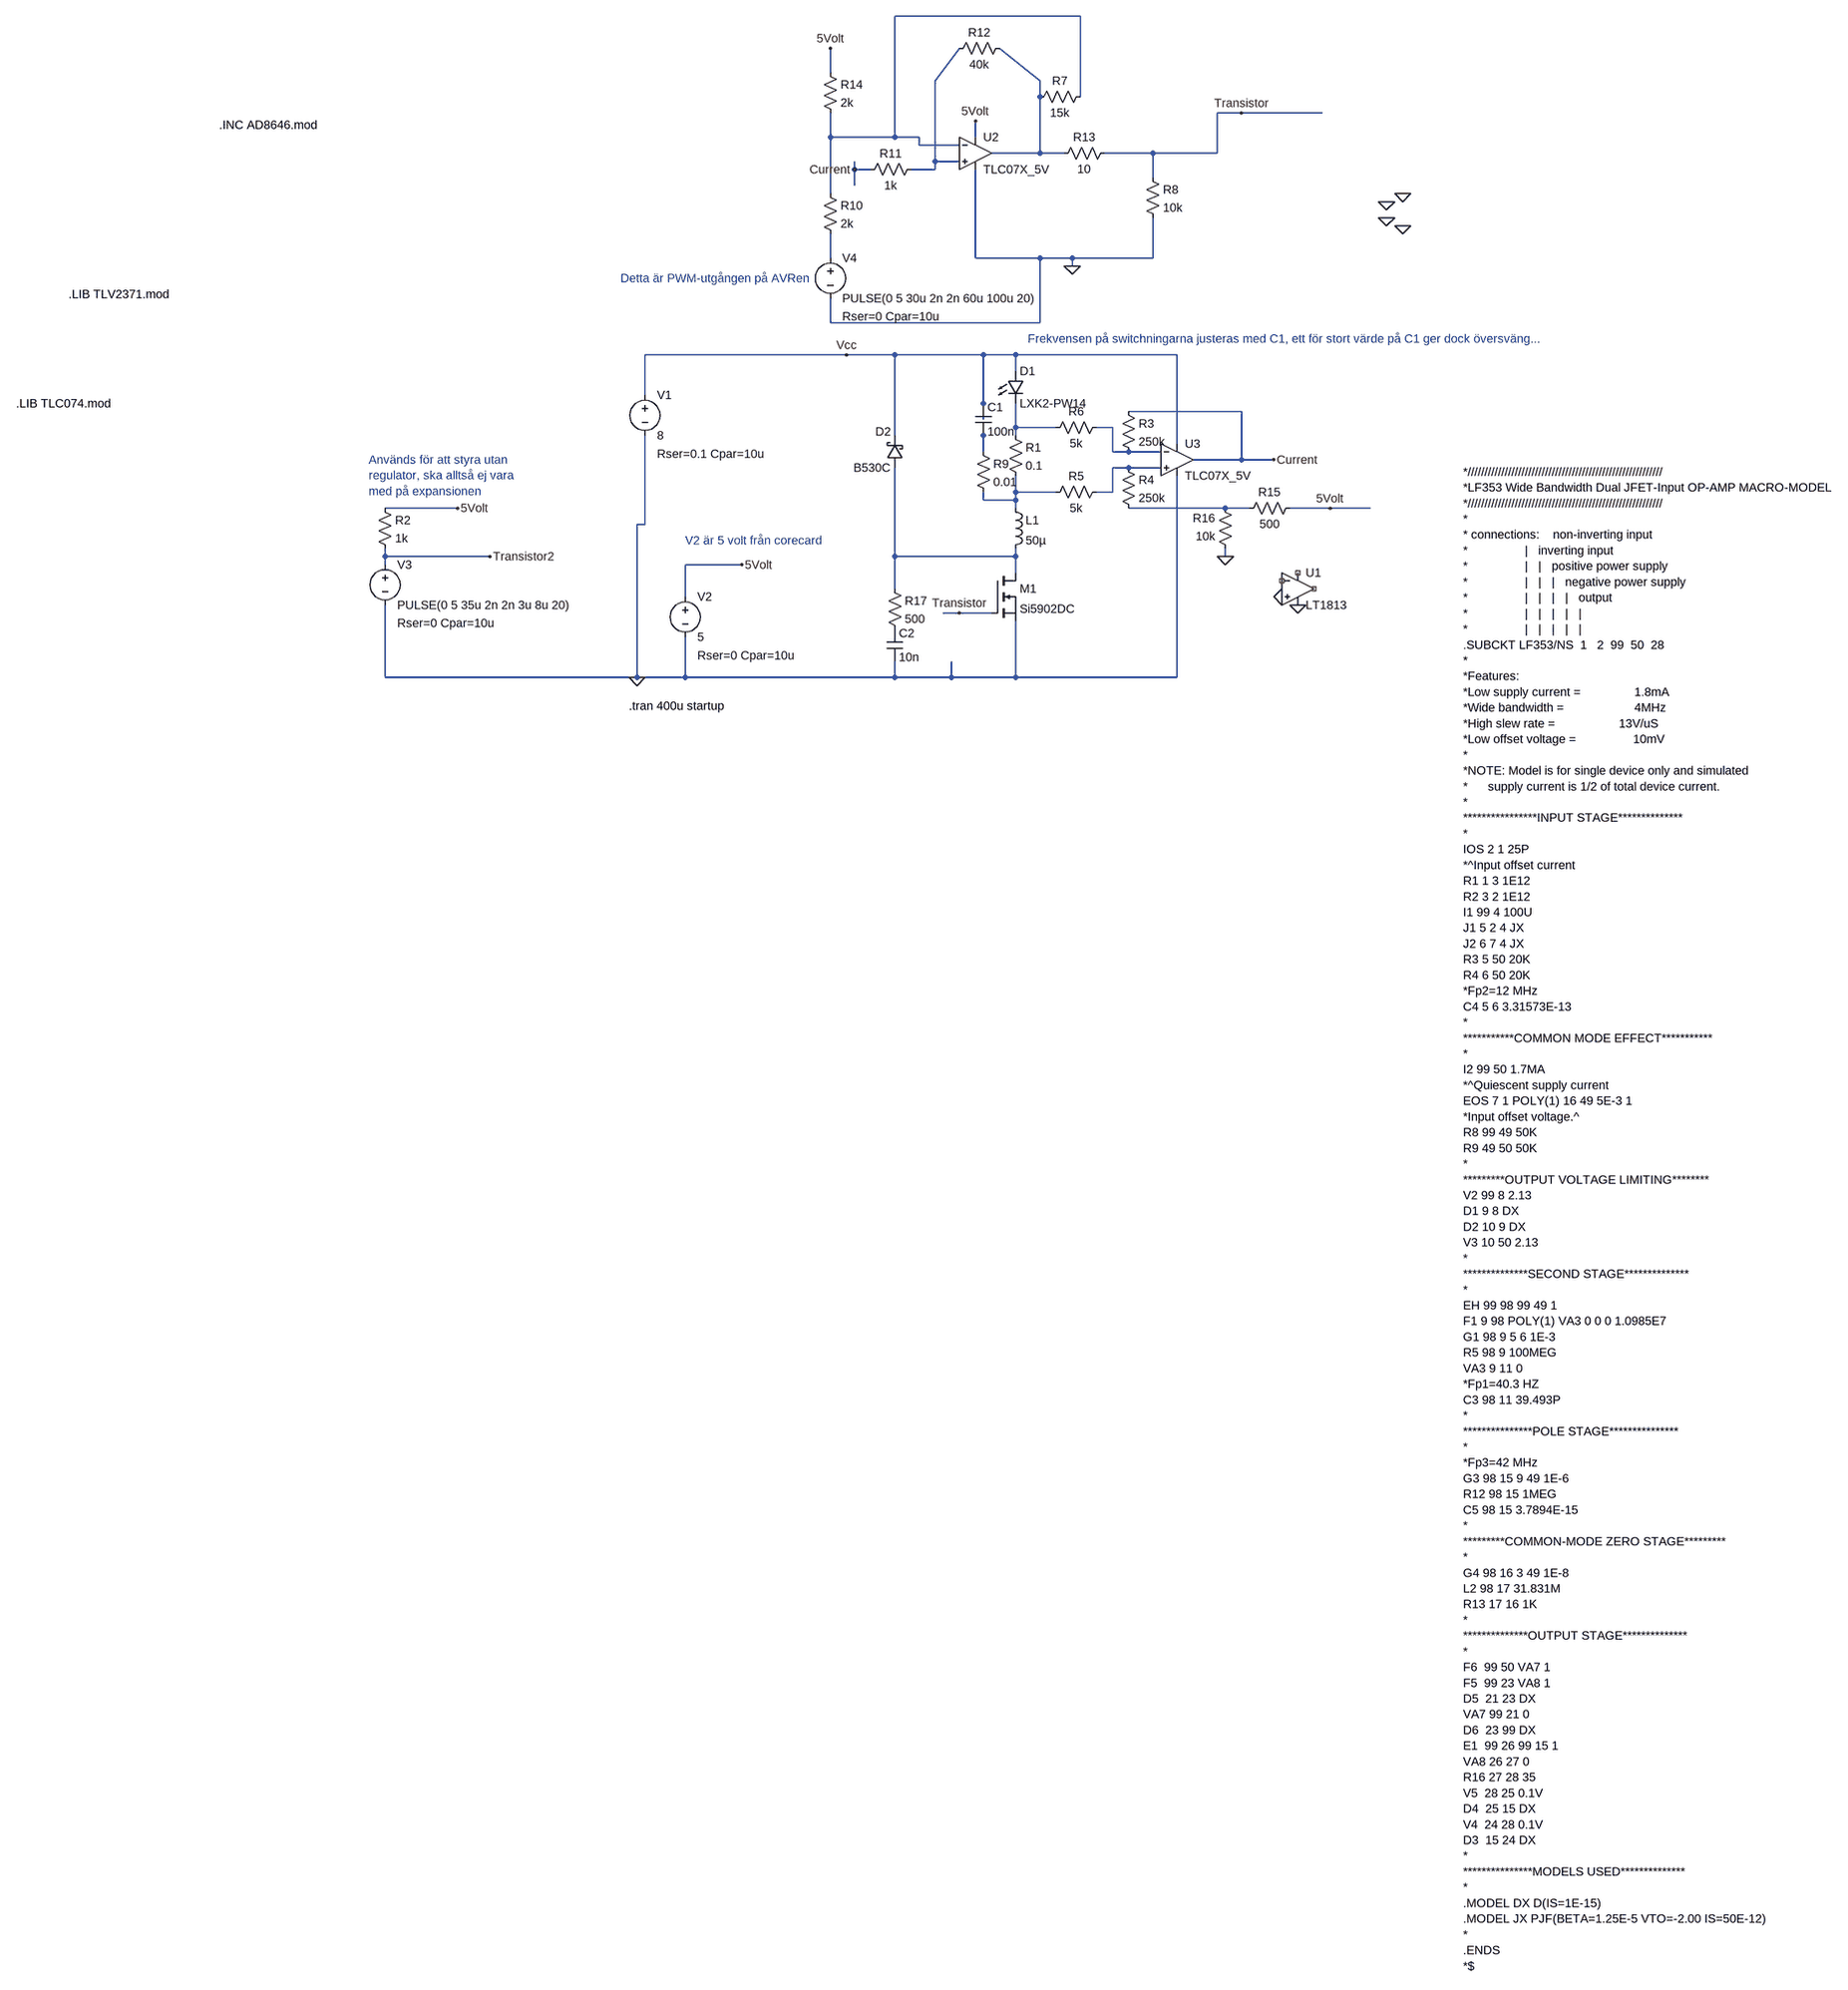
[diagram p0: schematic RGBW-driver.asc]
RGBW-driver.asc, the LTspice schematic file:
Version 4
SHEET 1 19580 6792
WIRE 768 -768 400 -768
WIRE 272 -656 272 -704
WIRE 480 -640 528 -704
WIRE 688 -640 608 -704
WIRE 688 -608 688 -640
WIRE 768 -608 768 -768
WIRE 1088 -576 1040 -576
WIRE 1248 -576 1088 -576
WIRE 272 -528 272 -576
WIRE 400 -528 400 -768
WIRE 400 -528 272 -528
WIRE 448 -528 400 -528
WIRE 560 -528 560 -560
WIRE 448 -512 448 -528
WIRE 528 -512 448 -512
WIRE 688 -496 688 -608
WIRE 688 -496 592 -496
WIRE 736 -496 688 -496
WIRE 912 -496 816 -496
WIRE 1040 -496 1040 -576
WIRE 1040 -496 912 -496
WIRE 480 -480 480 -640
WIRE 528 -480 480 -480
WIRE 320 -464 320 -480
WIRE 352 -464 320 -464
WIRE 480 -464 480 -480
WIRE 480 -464 432 -464
WIRE 912 -448 912 -496
WIRE 320 -432 320 -464
WIRE 272 -416 272 -528
WIRE 272 -288 272 -336
WIRE 560 -288 560 -464
WIRE 688 -288 560 -288
WIRE 752 -288 688 -288
WIRE 912 -288 912 -368
WIRE 912 -288 752 -288
WIRE 752 -272 752 -288
WIRE 272 -160 272 -208
WIRE 688 -160 688 -288
WIRE 688 -160 272 -160
WIRE 304 -96 -96 -96
WIRE 400 -96 304 -96
WIRE 576 -96 400 -96
WIRE 640 -96 576 -96
WIRE 960 -96 640 -96
WIRE 640 -64 640 -96
WIRE -96 -16 -96 -96
WIRE 576 0 576 -96
WIRE 1088 16 864 16
WIRE 576 32 576 0
WIRE 640 48 640 0
WIRE 720 48 640 48
WIRE 832 48 800 48
WIRE 400 64 400 -96
WIRE 576 64 576 48
WIRE 640 64 640 48
WIRE 960 80 960 -96
WIRE 576 96 576 64
WIRE 832 96 832 48
WIRE 864 96 832 96
WIRE 928 96 864 96
WIRE 1088 112 1088 16
WIRE 1088 112 992 112
WIRE 1152 112 1088 112
WIRE 864 128 832 128
WIRE 928 128 864 128
WIRE 640 176 640 144
WIRE 720 176 640 176
WIRE 832 176 832 128
WIRE 832 176 800 176
WIRE 576 192 576 176
WIRE 640 192 640 176
WIRE 640 192 576 192
WIRE -608 208 -752 208
WIRE 640 208 640 192
WIRE 1056 208 864 208
WIRE 1104 208 1056 208
WIRE 1264 208 1184 208
WIRE 1344 208 1264 208
WIRE -96 240 -96 64
WIRE -96 240 -112 240
WIRE -752 304 -752 288
WIRE -544 304 -752 304
WIRE 400 304 400 128
WIRE 640 304 640 288
WIRE 640 304 400 304
WIRE 1056 304 1056 288
WIRE -752 320 -752 304
WIRE 96 320 -16 320
WIRE 640 336 640 304
WIRE 400 368 400 304
WIRE -16 384 -16 320
WIRE 528 416 496 416
WIRE 592 416 528 416
WIRE -752 544 -752 400
WIRE -112 544 -112 240
WIRE -112 544 -752 544
WIRE -16 544 -16 464
WIRE -16 544 -112 544
WIRE 400 544 400 512
WIRE 400 544 -16 544
WIRE 512 544 512 512
WIRE 512 544 400 544
WIRE 640 544 640 432
WIRE 640 544 512 544
WIRE 960 544 960 144
WIRE 960 544 640 544
FLAG -112 544 0
FLAG 304 -96 Vcc
FLAG 752 -272 0
FLAG 320 -464 Current
FLAG 1152 112 Current
FLAG 1088 -576 Transistor
FLAG -544 304 Transistor2
FLAG 96 320 5Volt
FLAG 1264 208 5Volt
FLAG 560 -560 5Volt
FLAG 272 -704 5Volt
FLAG -608 208 5Volt
FLAG 1200 400 0
FLAG 1168 384 0
FLAG 1408 -352 0
FLAG 1376 -368 0
FLAG 1376 -400 0
FLAG 1408 -416 0
FLAG 1056 304 0
FLAG 528 416 Transistor
SYMBOL LED 624 -64 R0
SYMATTR InstName D1
SYMATTR Value LXK2-PW14
SYMBOL ind 624 192 R0
SYMATTR InstName L1
SYMATTR Value 50µ
SYMATTR SpiceLine Ipk=1.25 Rser=0.165 Rpar=9425 Cpar=0
SYMBOL voltage -96 -32 R0
WINDOW 123 0 0 Left 0
WINDOW 39 24 132 Left 0
SYMATTR SpiceLine Rser=0.1 Cpar=10u
SYMATTR InstName V1
SYMATTR Value 8
SYMBOL res 624 48 R0
SYMATTR InstName R1
SYMATTR Value 0.1
SYMBOL nmos 592 336 R0
SYMATTR InstName M1
SYMATTR Value Si5902DC
SYMBOL schottky 416 128 R180
WINDOW 0 24 72 Left 0
WINDOW 3 24 0 Left 0
SYMATTR InstName D2
SYMATTR Value B530C
SYMATTR Description Diode
SYMATTR Type diode
SYMBOL voltage -16 368 R0
WINDOW 123 0 0 Left 0
WINDOW 39 24 132 Left 0
SYMATTR SpiceLine Rser=0 Cpar=10u
SYMATTR InstName V2
SYMATTR Value 5
SYMBOL res -768 192 R0
SYMATTR InstName R2
SYMATTR Value 1k
SYMBOL voltage -752 304 R0
WINDOW 123 0 0 Left 0
WINDOW 39 24 132 Left 0
SYMATTR SpiceLine Rser=0 Cpar=10u
SYMATTR InstName V3
SYMATTR Value PULSE(0 5 35u 2n 2n 3u 8u 20)
SYMBOL Opamps\\LT1813 1200 304 R0
SYMATTR InstName U1
SYMBOL res 848 0 R0
SYMATTR InstName R3
SYMATTR Value 250k
SYMBOL res 848 112 R0
SYMATTR InstName R4
SYMATTR Value 250k
SYMBOL res 816 160 R90
WINDOW 0 0 56 VBottom 0
WINDOW 3 32 56 VTop 0
SYMATTR InstName R5
SYMATTR Value 5k
SYMBOL res 816 32 R90
WINDOW 0 0 56 VBottom 0
WINDOW 3 32 56 VTop 0
SYMATTR InstName R6
SYMATTR Value 5k
SYMBOL res 256 -432 R0
SYMATTR InstName R10
SYMATTR Value 2k
SYMBOL res 448 -480 R90
WINDOW 0 0 56 VBottom 0
WINDOW 3 32 56 VTop 0
SYMATTR InstName R11
SYMATTR Value 1k
SYMBOL res 624 -720 R90
WINDOW 0 0 56 VBottom 0
WINDOW 3 32 56 VTop 0
SYMATTR InstName R12
SYMATTR Value 40k
SYMBOL res 832 -512 R90
WINDOW 0 0 56 VBottom 0
WINDOW 3 32 56 VTop 0
SYMATTR InstName R13
SYMATTR Value 10
SYMBOL res 256 -672 R0
SYMATTR InstName R14
SYMATTR Value 2k
SYMBOL res 896 -464 R0
SYMATTR InstName R8
SYMATTR Value 10k
SYMBOL voltage 272 -304 R0
WINDOW 123 0 0 Left 0
WINDOW 39 24 132 Left 0
SYMATTR SpiceLine Rser=0 Cpar=10u
SYMATTR InstName V4
SYMATTR Value PULSE(0 5 30u 2n 2n 60u 100u 20)
SYMBOL cap 560 0 R0
SYMATTR InstName C1
SYMATTR Value 100n
SYMATTR SpiceLine V=10 Irms=10.541 Rser=0.004 Lser=0
SYMBOL res 560 80 R0
SYMATTR InstName R9
SYMATTR Value 0.01
SYMBOL Opamps\\opamp2 960 48 R0
SYMATTR InstName U3
SYMATTR Value TLC07X_5V
SYMBOL Opamps\\opamp2 560 -560 R0
SYMATTR InstName U2
SYMATTR Value TLC07X_5V
SYMBOL res 672 -592 R270
WINDOW 0 32 56 VTop 0
WINDOW 3 0 56 VBottom 0
SYMATTR InstName R7
SYMATTR Value 15k
SYMBOL res 1200 192 R90
WINDOW 0 0 56 VBottom 0
WINDOW 3 32 56 VTop 0
SYMATTR InstName R15
SYMATTR Value 500
SYMBOL res 1072 304 R180
WINDOW 0 36 76 Left 0
WINDOW 3 36 40 Left 0
SYMATTR InstName R16
SYMATTR Value 10k
SYMBOL res 384 352 R0
SYMATTR InstName R17
SYMATTR Value 500
SYMBOL cap 384 448 R0
SYMATTR InstName C2
SYMATTR Value 10n
TEXT -128 600 Left 0 !.tran 400u startup
TEXT -144 -248 Left 0 ;Detta är PWM-utgången på AVRen
TEXT 664 -128 Left 0 ;Frekvensen på switchningarna justeras med C1, ett för stort värde på C1 ger dock översväng...
TEXT -16 272 Left 0 ;V2 är 5 volt från corecard
TEXT -784 112 Left 0 ;Används för att styra utan\nregulator, ska alltså ej vara\nmed på expansionen
TEXT -1536 0 Left 0 !.LIB TLC074.mod
TEXT -1432 -216 Left 0 !.LIB TLV2371.mod
TEXT -1128 -552 Left 0 !.INC AD8646.mod
TEXT 1528 136 Left 0 !*//////////////////////////////////////////////////////////\n*LF353 Wide Bandwidth Dual JFET-Input OP-AMP MACRO-MODEL\n*//////////////////////////////////////////////////////////\n*\n* connections:    non-inverting input\n*                 |   inverting input\n*                 |   |   positive power supply\n*                 |   |   |   negative power supply\n*                 |   |   |   |   output\n*                 |   |   |   |   |\n*                 |   |   |   |   |\n.SUBCKT LF353/NS  1   2  99  50  28\n*\n*Features:\n*Low supply current =                1.8mA\n*Wide bandwidth =                     4MHz\n*High slew rate =                   13V/uS\n*Low offset voltage =                 10mV\n*\n*NOTE: Model is for single device only and simulated\n*      supply current is 1/2 of total device current.\n*\n****************INPUT STAGE************** \n*\nIOS 2 1 25P\n*^Input offset current\nR1 1 3 1E12\nR2 3 2 1E12\nI1 99 4 100U\nJ1 5 2 4 JX\nJ2 6 7 4 JX\nR3 5 50 20K\nR4 6 50 20K\n*Fp2=12 MHz\nC4 5 6 3.31573E-13\n*\n***********COMMON MODE EFFECT***********\n*\nI2 99 50 1.7MA\n*^Quiescent supply current\nEOS 7 1 POLY(1) 16 49 5E-3 1\n*Input offset voltage.^\nR8 99 49 50K\nR9 49 50 50K\n*\n*********OUTPUT VOLTAGE LIMITING********\nV2 99 8 2.13\nD1 9 8 DX\nD2 10 9 DX\nV3 10 50 2.13\n*\n**************SECOND STAGE**************\n*\nEH 99 98 99 49 1\nF1 9 98 POLY(1) VA3 0 0 0 1.0985E7\nG1 98 9 5 6 1E-3\nR5 98 9 100MEG\nVA3 9 11 0\n*Fp1=40.3 HZ\nC3 98 11 39.493P\n*\n***************POLE STAGE***************\n*\n*Fp3=42 MHz\nG3 98 15 9 49 1E-6\nR12 98 15 1MEG\nC5 98 15 3.7894E-15\n*\n*********COMMON-MODE ZERO STAGE*********\n*\nG4 98 16 3 49 1E-8\nL2 98 17 31.831M\nR13 17 16 1K\n*\n**************OUTPUT STAGE**************\n*\nF6  99 50 VA7 1\nF5  99 23 VA8 1\nD5  21 23 DX\nVA7 99 21 0\nD6  23 99 DX\nE1  99 26 99 15 1\nVA8 26 27 0\nR16 27 28 35\nV5  28 25 0.1V\nD4  25 15 DX\nV4  24 28 0.1V\nD3  15 24 DX\n*\n***************MODELS USED**************\n*\n.MODEL DX D(IS=1E-15)\n.MODEL JX PJF(BETA=1.25E-5 VTO=-2.00 IS=50E-12)\n*\n.ENDS\n*$

The netlist it stands for:
* RGBW-driver.asc
D1 Vcc N005 LXK2-PW14
L1 N009 N011 50µ Ipk=1.25 Rser=0.165 Rpar=9425 Cpar=0
V1 Vcc 0 8 Rser=0.1 Cpar=10u
R1 N005 N009 0.1
M1 N011 Transistor 0 0 Si5902DC
D2 N011 Vcc B530C
V2 5Volt 0 5 Rser=0 Cpar=10u
R2 5Volt Transistor2 1k
V3 Transistor2 0 PULSE(0 5 35u 2n 2n 3u 8u 20) Rser=0 Cpar=10u
XU1 0 NC_01 NC_02 0 NC_03 LT1813  ; pins In+ In- V+ V- OUT
R3 Current N006 250k
R4 N008 N010 250k
R5 N008 N009 5k
R6 N006 N005 5k
R10 N001 N004 2k
R11 N002 Current 1k
R12 N003 N002 40k
R13 Transistor N003 10
R14 5Volt N001 2k
R8 Transistor 0 10k
V4 N004 0 PULSE(0 5 30u 2n 2n 60u 100u 20) Rser=0 Cpar=10u
C1 Vcc N007 100n V=10 Irms=10.541 Rser=0.004 Lser=0
R9 N007 N009 0.01
XU3 N008 N006 Vcc 0 Current TLC07X_5V  ; pins In+ In- V+ V- OUT
XU2 N002 N001 5Volt 0 N003 TLC07X_5V  ; pins In+ In- V+ V- OUT
R7 N003 N001 15k
R15 5Volt N010 500
R16 0 N010 10k
R17 N011 P001 500
C2 P001 0 10n
.model D D
.lib standard.dio
.model NMOS NMOS
.model PMOS PMOS
.lib standard.mos
.tran 400u startup
* Detta är PWM-utgången på AVRen
* Frekvensen på switchningarna justeras med C1, ett för stort värde på C1 ger dock översväng...
* V2 är 5 volt från corecard
* Används för att styra utan
* regulator, ska alltså ej vara
* med på expansionen
.LIB TLC074.mod
.LIB TLV2371.mod
.INC AD8646.mod
*//////////////////////////////////////////////////////////
*LF353 Wide Bandwidth Dual JFET-Input OP-AMP MACRO-MODEL
*//////////////////////////////////////////////////////////
*
* connections:    non-inverting input
*                 |   inverting input
*                 |   |   positive power supply
*                 |   |   |   negative power supply
*                 |   |   |   |   output
*                 |   |   |   |   |
*                 |   |   |   |   |
.SUBCKT LF353/NS  1   2  99  50  28
*
*Features:
*Low supply current =                1.8mA
*Wide bandwidth =                     4MHz
*High slew rate =                   13V/uS
*Low offset voltage =                 10mV
*
*NOTE: Model is for single device only and simulated
*      supply current is 1/2 of total device current.
*
****************INPUT STAGE**************
*
IOS 2 1 25P
*^Input offset current
R1 1 3 1E12
R2 3 2 1E12
I1 99 4 100U
J1 5 2 4 JX
J2 6 7 4 JX
R3 5 50 20K
R4 6 50 20K
*Fp2=12 MHz
C4 5 6 3.31573E-13
*
***********COMMON MODE EFFECT***********
*
I2 99 50 1.7MA
*^Quiescent supply current
EOS 7 1 POLY(1) 16 49 5E-3 1
*Input offset voltage.^
R8 99 49 50K
R9 49 50 50K
*
*********OUTPUT VOLTAGE LIMITING********
V2 99 8 2.13
D1 9 8 DX
D2 10 9 DX
V3 10 50 2.13
*
**************SECOND STAGE**************
*
EH 99 98 99 49 1
F1 9 98 POLY(1) VA3 0 0 0 1.0985E7
G1 98 9 5 6 1E-3
R5 98 9 100MEG
VA3 9 11 0
*Fp1=40.3 HZ
C3 98 11 39.493P
*
***************POLE STAGE***************
*
*Fp3=42 MHz
G3 98 15 9 49 1E-6
R12 98 15 1MEG
C5 98 15 3.7894E-15
*
*********COMMON-MODE ZERO STAGE*********
*
G4 98 16 3 49 1E-8
L2 98 17 31.831M
R13 17 16 1K
*
**************OUTPUT STAGE**************
*
F6  99 50 VA7 1
F5  99 23 VA8 1
D5  21 23 DX
VA7 99 21 0
D6  23 99 DX
E1  99 26 99 15 1
VA8 26 27 0
R16 27 28 35
V5  28 25 0.1V
D4  25 15 DX
V4  24 28 0.1V
D3  15 24 DX
*
***************MODELS USED**************
*
.MODEL DX D(IS=1E-15)
.MODEL JX PJF(BETA=1.25E-5 VTO=-2.00 IS=50E-12)
*
.ENDS
*$
.lib LTC.lib
.backanno
.end